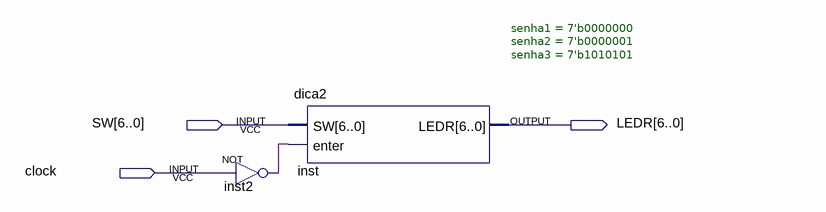
[diagram p0: schematic sheet]
// Quartus schematic final.bdf as structural Verilog: 2 symbols, 3 pins
module \final  (
  input  [6:0] SW,
  input  clock,
  output [6:0] LEDR
);

  wire inst2_out;

  not inst2 (inst2_out, clock);
  dica2 #(.senha1(7'b0000000), .senha2(7'b0000001), .senha3(7'b1010101)) inst (.SW(SW), .enter(inst2_out), .LEDR(LEDR));
endmodule
